# Altium schematic sheet WIZARD_Control.SchDoc
size Letter; SheetNumber: 2; SheetTotal: 2
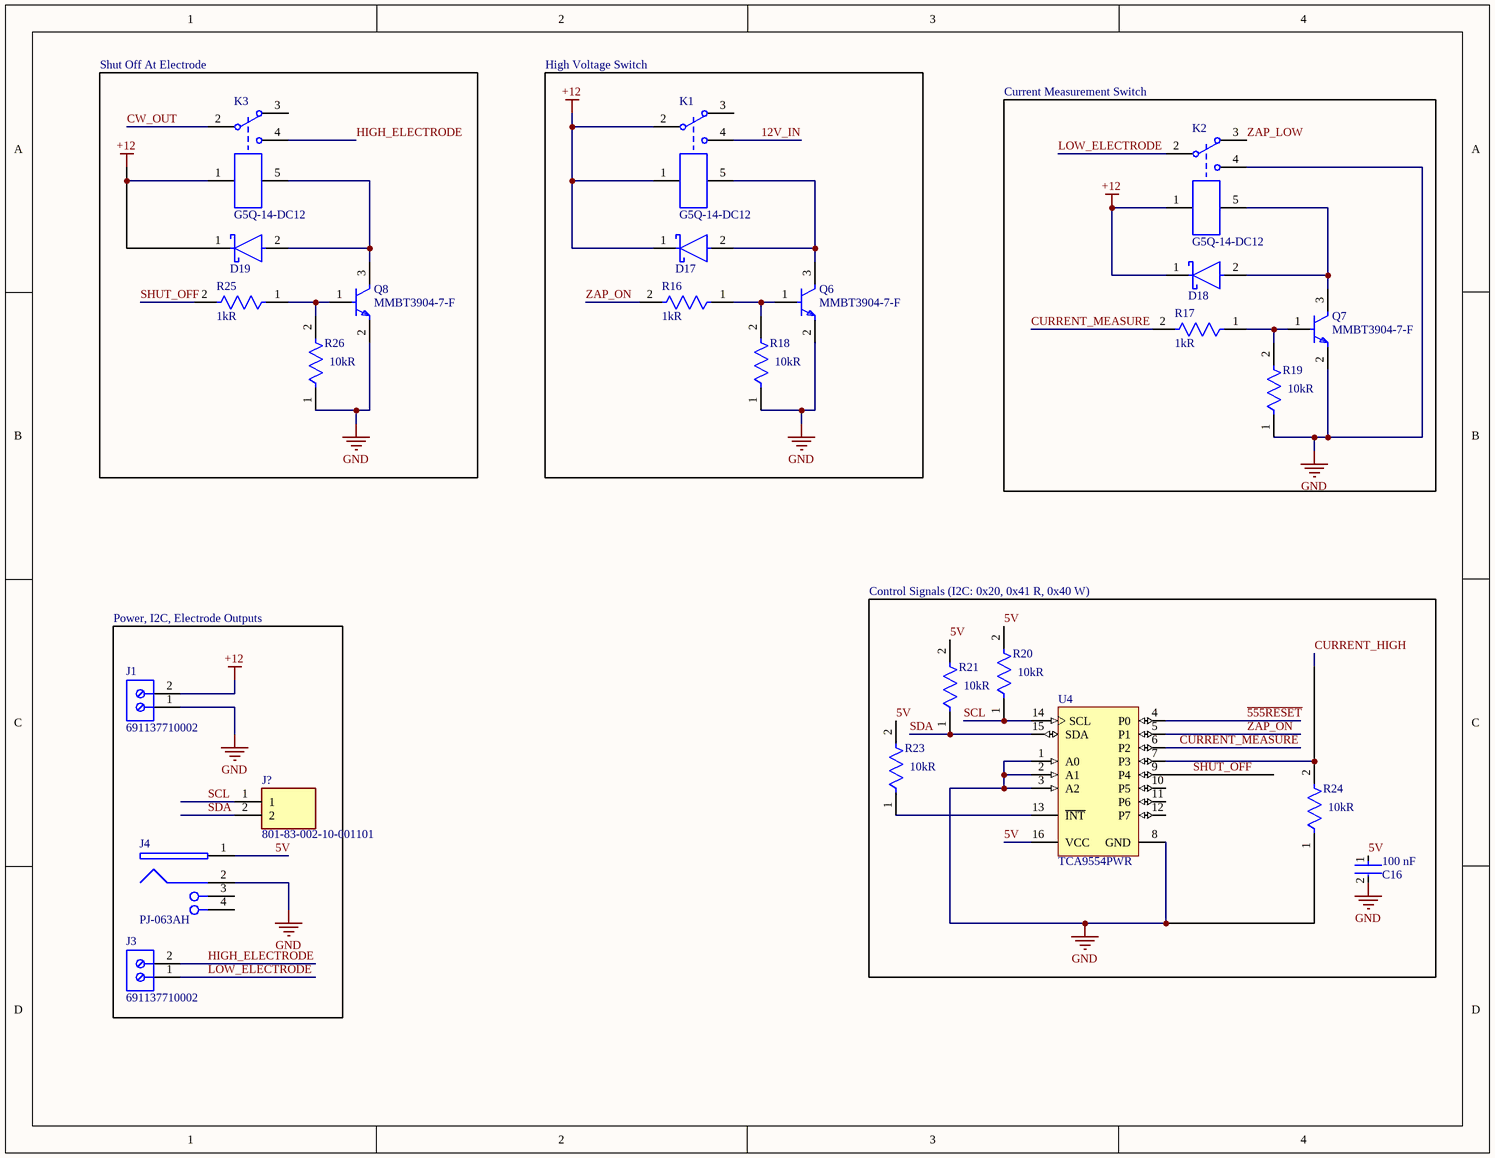
[diagram p0: WIZARD_Control.SchDoc]

## Parts
C16  Capacitance: 100 nF  [FP-CC0805-0_85-MFG]  (hidden comment: CC0805KRX7R9BB104)
D17  SK520B  [FP-SMB-MFG]  (value not drawn)
D18  SK520B  [FP-SMB-MFG]  (value not drawn)
D19  SK520B  [FP-SMB-MFG]  (value not drawn)
J1  691137710002  [691137710002]
J3  691137710002  [691137710002]
J4  PJ-063AH  [CUI-PJ-063AH_V]
J?  801-83-002-10-001101  [RHDR2W60P0X254_1X2_508X254X700P]
K1  G5Q-14-DC12  [OMRON-G5Q-14-5_V]
K2  G5Q-14-DC12  [OMRON-G5Q-14-5_V]
K3  G5Q-14-DC12  [OMRON-G5Q-14-5_V]
Q6  MMBT3904-7-F  [FP-SOT23-IPC_A]
Q7  MMBT3904-7-F  [FP-SOT23-IPC_A]
Q8  MMBT3904-7-F  [FP-SOT23-IPC_A]
R16  Resistance: 1kR  [FP-RR1220-IPC_A]  (hidden comment: RR1220P-102-D)
R17  Resistance: 1kR  [FP-RR1220-IPC_A]  (hidden comment: RR1220P-102-D)
R18  Resistance: 10kR  [FP-RR1220-IPC_A]  (hidden comment: RR1220P-103-D)
R19  Resistance: 10kR  [FP-RR1220-IPC_A]  (hidden comment: RR1220P-103-D)
R20  Resistance: 10kR  [FP-RR1220-IPC_A]  (hidden comment: RR1220P-103-D)
R21  Resistance: 10kR  [FP-RR1220-IPC_A]  (hidden comment: RR1220P-103-D)
R23  Resistance: 10kR  [FP-RR1220-IPC_A]  (hidden comment: RR1220P-103-D)
R24  Resistance: 10kR  [FP-RR1220-IPC_A]  (hidden comment: RR1220P-103-D)
R25  Resistance: 1kR  [FP-RR1220-IPC_A]  (hidden comment: RR1220P-102-D)
R26  Resistance: 10kR  [FP-RR1220-IPC_A]  (hidden comment: RR1220P-103-D)
U4  TCA9554PWR  [PW0016A_M]

## Blocks framed on the sheet
Shut Off At Electrode: D19 K3 Q8 R25 R26
High Voltage Switch: D17 K1 Q6 R16 R18
Current Measurement Switch: D18 K2 Q7 R17 R19
Power, I2C, Electrode Outputs: J1 J3 J4 J?
Control Signals (I2C: 0x20, 0x41 R, 0x40 W): C16 R20 R21 R23 R24 U4

## Nets
+12: D17.1(C) D18.1(C) D19.1(C) J1.2 K1.1 K1.2 K2.1 K3.1
GND: C16.2 J1.1 J4.2 K2.4 Q6.2(E) Q7.2(E) Q8.2(E) R18.1 R19.1 R24.1 R26.1 U4.1(A0) U4.2(A1) U4.3(A2) U4.8(GND)
~{555RESET}: U4.4(P0)
5V: C16.1 J4.1 R20.2 R21.2 R23.2 U4.16(VCC)
12V_IN: K1.4
CURRENT_HIGH: R24.2 U4.7(P3)
CURRENT_MEASURE: R17.2 U4.6(P2)
CW_OUT: K3.2
HIGH_ELECTRODE: J3.2 K3.4
LOW_ELECTRODE: J3.1 K2.2
SCL: J?.1 R20.1 U4.14(SCL)
SDA: J?.2 R21.1 U4.15(SDA)
SHUT_OFF: R25.2 U4.9(P4)
ZAP_LOW: K2.3
ZAP_ON: R16.2 U4.5(P1)
NetD17_2: D17.2(A) K1.5 Q6.3(C)
NetD18_2: D18.2(A) K2.5 Q7.3(C)
NetD19_2: D19.2(A) K3.5 Q8.3(C)
NetQ6_1: Q6.1(B) R16.1 R18.2
NetQ7_1: Q7.1(B) R17.1 R19.2
NetQ8_1: Q8.1(B) R25.1 R26.2
NetR23_1: R23.1 U4.13(~{INT})

Not connected (* = marked no-connect by the designer): J4 3(SHLD) 4(SHLD); K1 3; K3 3; U4 10(P5) 11(P6) 12(P7)

## Library data of the parts
C16 = CMP-2100-03606-3: CAP CER 0.1UF 50V X7R 0805; Manufacturer: Yageo; Tolerance: 0.1; Value: 100 nF; Material: Ceramic; Device Class L1: Passive Components; ComponentLink2Description: Datasheet; Package: CC0805-0.85; Manufacturer Part Number: CC0805KRX7R9BB104; Digikey Description: CAP CER 0.1UF 50V X7R 0805; Device Class L3: Ceramic Capacitors; Temperature: -30°C to +85°C; Temperature Characteristic: X7R; Voltage Rating: 50 V; Height: 0.95mm; RoHS: TRUE; Ipc Land Pattern Name: CAPC200125X85; Device Class L2: Capacitors; Category: Cap; Temperature Range Low: -30°C; Temperature Range High: +85°C; Mouser Description: Multilayer Ceramic Capacitors MLCC - SMD/SMT 100nF 50V X7R 10%; Footprint Url: http://www.yageo.com/exep/pages/download/literatures/UPY-C_GEN_24.pdf; Automotive: No; Octopart: https://octopart.com/cc0805krx7r9bb104-yageo-192993; Lead Free: Yes; ComponentLink2URL: http://www.yageo.com/documents/recent/UPY-GPHC_Y5V_6.3V-to-50V_8.pdf
D17-D19 = CMP-10078-124483505-1: SK520B Diode Schottky 200V 5A Smb; Peak Reverse Current: 200nA; Capacitance: 140pF; Max Junction Temperature (Tj): 150°C; Max Forward Surge Current (Ifsm): 110A; Max Repetitive Reverse Voltage (Vrrm): 200V; NexarPartId: 124483505; Case/Package: SMB; Forward Current: 5A; Max Operating Temperature: 150°C; Min Operating Temperature: -55°C; Height: 2.6mm; Reverse Voltage: 200V
J1 J3 = CMP-1502-03324-2: NexarPartId: 78871135; Voltage Rating: 300V; Number of Contacts: 2; Current Rating: 16A; Lead Pitch: 5mm; Height: 11.6mm; Packaging: Box; RoHS: Non-Compliant; Contact Material: Nickel, Tin; Max Operating Temperature: 120°C; Number of Pins: 2; Min Operating Temperature: -30°C; Number of Rows: 1
J4 = CMP-2000-06898-1: Through Hole Right Angle DC Power Jack, 8 A, 2 mm Center Pin, 2 Position, -25 to 85 degC, RoHS, Bulk; Manufacturer: CUIInc.; Voltage Rating: 24V; Current Rating: 8A; Inside Contact Diameter: 2mm; Insulation Resistance: 100MOhms; Outside Contact Diameter: 6.5mm; Brand: CUI; Termination Style: ThroughHole; Flammability Rating: UL94V-0; Datasheet Version: Rev. 1.02, 03/2016; Manufacturer URL: http://www.cui.com/; Product Category: DCPowerConnectors; Package Description: 2-Pin Through Hole Device, Body 13 x 10 mm, Height 9 mm; Connector Type: DCPowerJack; Factory Pack Quantity: 500; Contact Plating: Nickel; Mounting Style: KinkedPin; Contact Material: Copper; RoHS: True; Mounting Angle: Right; Package Reference: PJ-063AH; Product: Jacks; Contact Gender: Male; Datasheet URL: http://www.cui.com/product/resource/pj-063ah.pdf; Housing Material: PolybutyleneTerephthalate(PBT); Mounting Technology: ThroughHole; Operating Temperature Range: -25Cto+85C
J? = 801-83-002-10-001101: 2.54/5.08 mm, Straight solder tail, Mating pin  0.76 mm,  positions; Manufacturer_Name: Preci-Dip; Geometry.Height: 7mm; Mouser Part Number: 437-8018300210001101; Mouser Price/Stock: https://www.mouser.co.uk/ProductDetail/Preci-dip/801-83-002-10-001101?qs=FtMuP6KVi2SapQB4HbL8Ng%3D%3D; Manufacturer_Part_Number: 801-83-002-10-001101; Datasheet Link: https://www.precidip.com/AppHost/9696,1/Scripts/Modules/Catalog/Default.aspx?c=7&i=310&p=107&pdf=1&dsku=801-PP-NNN-10-001101
K1-K3 = CMP-2000-06307-2: A Miniature Power Relay with 1-Pole 10 A Switching Capacity, 12 V, 33.3 mA, -40 to 105 degC, 5-Pin THD, RoHS, Bulk; Manufacturer: Omron Electronic Components; PartNumber: G5Q; Coil Resistance: 360Ohm; Coil Voltage: 12V; Coil Current: 33.3mA; Contact Form: SPDT; Power Rating: 0.4W; Manufacturer URL: http://www.omron.com/; Package URL: https://www.omron.com/ecb/products/pdf/en-g5q.pdf; Datasheet URL: https://www.omron.com/ecb/products/pdf/en-g5q.pdf; Contact Material: SilverAlloy; Mounting Style: ThroughHole; Mounting Technology: ThroughHole; Package Description: 5-Pin Through Hole Device, Body 20 x 10 mm; Current Rating: 33.3mA; Package Reference: G5Q-14-5; Datasheet Version: 03/2016
Q6-Q8 = CMP-2000-04931-2: TRANS NPN 40V 0.2A SMD SOT23-3; Frequency: 300MHz; Power Dissipation: 350mW; Element Configuration: Single; Max Power Dissipation: 300mW; Max Collector Current: 200mA; Collector Emitter Saturation Voltage: 300mV; Number of Elements: 1; hFE Min: 100; Collector Base Voltage (VCBO): 60V; Emitter Base Voltage (VEBO): 6V; Contact Plating: Tin; Package Quantity: 3000; Max Frequency: 300MHz; REACH SVHC: No SVHC; Max Operating Temperature: 150°C; Width: 1.4mm; Collector Emitter Voltage (VCEO): 40V; Voltage Rating (DC): 40V; Radiation Hardening: No; Case/Package: SOT-23; Height: 1mm; Collector Emitter Breakdown Voltage: 40V; Length: 3.05mm; Polarity: NPN; Packaging: Tape and Reel; Number of Pins: 3; Min Operating Temperature: -55°C; Gain Bandwidth Product: 300MHz; Mount: Surface Mount; Weight: 0.000282oz; Continuous Collector Current: 200mA; Transition Frequency: 300MHz; Max Breakdown Voltage: 40V; Lead Free: Lead Free
R16 R17 R25 = CMP-2001-03210-2: 1kΩ ±0.5% 0.1W 1/10W Chip Resistor 0805 (2012 Metric) Thin Film; Voltage Rating (DC): 100V; Temperature Coefficient: 25ppm/°C; Power Rating: 100mW; Packaging: Tape and Reel; Max Operating Temperature: 125°C; Resistor Type: Thin Film; Length: 2mm; Number of Terminations: 2; Resistance Tolerance: 0.5%; Termination: SMD/SMT; Height: 0.4mm; Max Power Dissipation: 100mW; Lead Free: Lead Free; Min Operating Temperature: -55°C; Size Code: 0805; Voltage Rating: 100V; Package Quantity: 1; Width: 1.25mm; Depth: 1.25mm; Case/Package: 0805; Case Code (Imperial): 0805; Case Code (Metric): 2012; Tolerance: 0.5%; Series: RR; RoHS Compliant: Yes; Technology: THIN FILM
R18-R21 R23 R24 R26 = CMP-2001-03215-2: 10kΩ ±0.5% 0.1W 1/10W Chip Resistor 0805 (2012 Metric) Thin Film; Max Power Dissipation: 100mW; Voltage Rating: 100V; Temperature Coefficient: 25ppm/°C; Size Code: 0805; RoHS Compliant: Yes; Package Quantity: 1; Resistance Tolerance: 0.5%; Depth: 1.25mm; Lead Free: Lead Free; Series: RR; Min Operating Temperature: -55°C; Weight: 0.000194oz; Width: 1.25mm; Packaging: Tape and Reel; Termination: SMD/SMT; Length: 2mm; Power Rating: 100mW; Case Code (Metric): 2012; Resistor Type: Thin Film; Height: 0.4mm; Case/Package: 0805; Case Code (Imperial): 0805; Technology: THIN FILM; Max Operating Temperature: 125°C; Voltage Rating (DC): 100V; Number of Terminations: 2; Tolerance: 0.5%
U4 = CMP-0314-00246-2: Remote 8-Bit I2C and SMBus I/O Expander, 1.65 to 5.5 V, -40 to 85 degC, 16-pin TSSOP (PW), Green (RoHS & no Sb/Br); Manufacturer: Texas Instruments; VCC(Min)(V): 1.65; Configuration Registers: Yes; I2C Address: 0100xxx; # of I/Os: 8; VCC(Max)(V): 5.5; fSCLK(Max)(MHz): 401; Max Frequency(kHz): 400; SubFamily: I2C IO Expander; Interrupt Output: Yes; Code_JEDEC: MO-153; 5V Tolerant I/O: Yes; PackageVersion: revG, Feb-2011; Vcc range(V): 1.65 to 5.5; PartNumber: TCA9554PWR; ComponentLink1URL: http://www.ti.com/general/docs/lit/getliterature.tsp?genericPartNumber=TCA9554&fileType=pdf; Mounting Technology: Surface Mount; ComponentLink1Description: Datasheet; PackageDescription: 16-Pin Plastic Thin Small Outline Package 5 x 4.4 mm Body ,0.65 mm Pitch; Eco-Plan: Green (RoHS & no Sb/Br); PackageReference: PW0016A; Low Power: Yes; DatasheetVersion: SCPS233